# Altium project driverv7.PrjPcb
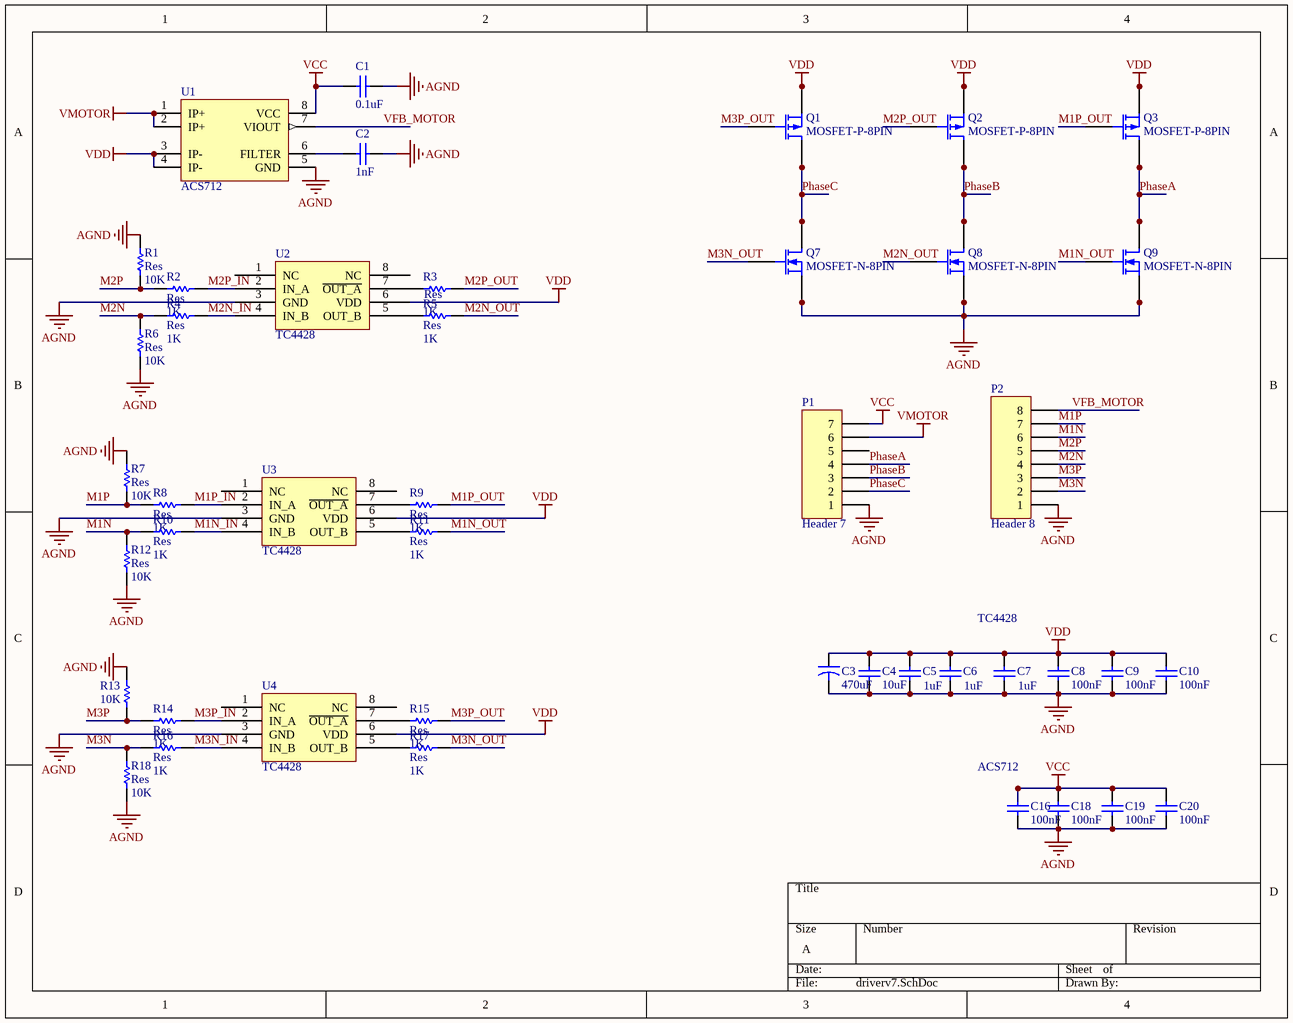
[diagram p0: driverv7.SchDoc]
1 sheet, 44 parts. Net scope: global (net labels, ports and power ports of the same name join across sheets).
Board file: driverv7-FPGA.PcbDoc

## Sheet driverv7.SchDoc
size A

### Parts
C1  value 0.1uF  [2012[0805]]  (hidden comment: Cap_UP)
C2  value 1nF  [2012[0805]]  (hidden comment: Cap_UP)
C3  value 470uF  [7343]  (hidden comment: Cap_El_200V)
C4  value 10uF  [2012[0805]]  (hidden comment: Cap_UP)
C5  value 1uF  [2012[0805]]  (hidden comment: Cap_UP)
C6  value 1uF  [2012[0805]]  (hidden comment: Cap_UP)
C7  value 1uF  [2012[0805]]  (hidden comment: Cap_UP)
C8  value 100nF  [2012[0805]]  (hidden comment: Cap_UP)
C9  value 100nF  [2012[0805]]  (hidden comment: Cap_UP)
C10  value 100nF  [2012[0805]]  (hidden comment: Cap_UP)
C16  value 100nF  [2012[0805]]  (hidden comment: Cap_UP)
C18  value 100nF  [2012[0805]]  (hidden comment: Cap_UP)
C19  value 100nF  [2012[0805]]  (hidden comment: Cap_UP)
C20  value 100nF  [2012[0805]]  (hidden comment: Cap_UP)
P1  Header 7  [HDR1X7]
P2  Header 8  [HDR1X8]
Q1  MOSFET-P-8PIN  [SO-8_N]
Q2  MOSFET-P-8PIN  [SO-8_N]
Q3  MOSFET-P-8PIN  [SO-8_N]
Q7  MOSFET-N-8PIN  [SO-8_N]
Q8  MOSFET-N-8PIN  [SO-8_N]
Q9  MOSFET-N-8PIN  [SO-8_N]
R1  Res  value 10K  [2012[0805]]
R2  Res  value 1K  [2012[0805]]
R3  Res  value 1K  [2012[0805]]
R4  Res  value 1K  [2012[0805]]
R5  Res  value 1K  [2012[0805]]
R6  Res  value 10K  [2012[0805]]
R7  Res  value 10K  [2012[0805]]
R8  Res  value 1K  [2012[0805]]
R9  Res  value 1K  [2012[0805]]
R10  Res  value 1K  [2012[0805]]
R11  Res  value 1K  [2012[0805]]
R12  Res  value 10K  [2012[0805]]
R13  value 10K  [2012[0805]]  (hidden comment: Res)
R14  Res  value 1K  [2012[0805]]
R15  Res  value 1K  [2012[0805]]
R16  Res  value 1K  [2012[0805]]
R17  Res  value 1K  [2012[0805]]
R18  Res  value 10K  [2012[0805]]
U1  ACS712  [8 pin SOIC_N]
U2  TC4428  [8 pin SOIC_M]
U3  TC4428  [8 pin SOIC_M]
U4  TC4428  [8 pin SOIC_M]

### Nets
AGND: C1.2 C2.2 C3.2 C4.1 C5.1 C6.1 C7.1 C8.1 C9.1 C10.1 C16.1 C18.1 C19.1 C20.1 P1.1 P2.1 Q7.1(S) Q7.2(S) Q7.3(S) Q8.1(S) Q8.2(S) Q8.3(S) Q9.1(S) Q9.2(S) Q9.3(S) R1.2 R6.1 R7.2 R12.1 R13.2 R18.1 U1.5(GND) U2.3(GND) U3.3(GND) U4.3(GND)
VCC: C1.1 C16.2 C18.2 C19.2 C20.2 P1.7 U1.8(VCC)
VDD: C3.1 C4.2 C5.2 C6.2 C7.2 C8.2 C9.2 C10.2 Q1.1(S) Q1.2(S) Q1.3(S) Q2.1(S) Q2.2(S) Q2.3(S) Q3.1(S) Q3.2(S) Q3.3(S) U1.3(IP-) U1.4(IP-) U2.6(VDD) U3.6(VDD) U4.6(VDD)
VMOTOR: P1.6 U1.1(IP+) U1.2(IP+)
M1N: P2.6 R10.1 R12.2
M1N_IN: R10.2 U3.4(IN_B)
M1N_OUT: Q9.4(G) R11.2
M1P: P2.7 R7.1 R8.1
M1P_IN: R8.2 U3.2(IN_A)
M1P_OUT: Q3.4(G) R9.2
M2N: P2.4 R4.1 R6.2
M2N_IN: R4.2 U2.4(IN_B)
M2N_OUT: Q8.4(G) R5.2
M2P: P2.5 R1.1 R2.1
M2P_IN: R2.2 U2.2(IN_A)
M2P_OUT: Q2.4(G) R3.2
M3N: P2.2 R16.1 R18.2
M3N_IN: R16.2 U4.4(IN_B)
M3N_OUT: Q7.4(G) R17.2
M3P: P2.3 R13.1 R14.1
M3P_IN: R14.2 U4.2(IN_A)
M3P_OUT: Q1.4(G) R15.2
PhaseA: P1.4 Q3.5(D) Q3.6(D) Q3.7(D) Q3.8(D) Q9.5(D) Q9.6(D) Q9.7(D) Q9.8(D)
PhaseB: P1.3 Q2.5(D) Q2.6(D) Q2.7(D) Q2.8(D) Q8.5(D) Q8.6(D) Q8.7(D) Q8.8(D)
PhaseC: P1.2 Q1.5(D) Q1.6(D) Q1.7(D) Q1.8(D) Q7.5(D) Q7.6(D) Q7.7(D) Q7.8(D)
VFB_MOTOR: P2.8 U1.7(VIOUT)
NetC2_1: C2.1 U1.6(FILTER)
NetR3_1: R3.1 U2.7(~{OUT_A})
NetR5_1: R5.1 U2.5(OUT_B)
NetR9_1: R9.1 U3.7(~{OUT_A})
NetR11_1: R11.1 U3.5(OUT_B)
NetR15_1: R15.1 U4.7(~{OUT_A})
NetR17_1: R17.1 U4.5(OUT_B)

Not connected (* = marked no-connect by the designer): P1 5; U2 1(NC) 8(NC); U3 1(NC) 8(NC); U4 1(NC) 8(NC)

### Notes on the sheet
- TC4428
- (near C16) ACS712

### Library data of the parts
C1 C2 C4-C10 C16 C18-C20 = Cap_UP: Capacitor; Published: 8-Jun-2000; LatestRevisionDate: 17-Jul-2002; LatestRevisionNote: Re-released for DXP Platform.; PackageReference: RAD-0.3; Publisher: Altium Limited
C3 = Cap_El_200V: Capacitor; Published: 23-Sep-2002; PackageReference: CAPR5-4X5; Publisher: Altium Limited
P1 = Header 7: Header, 7-Pin; LatestRevisionDate: 17-Jul-2002; LatestRevisionNote: Re-released for DXP Platform.; Publisher: Altium Limited
P2 = Header 8: Header, 8-Pin; LatestRevisionDate: 17-Jul-2002; LatestRevisionNote: Re-released for DXP Platform.; Publisher: Altium Limited
Q1-Q3 = MOSFET-P-8PIN: P-Channel MOSFET; PackageDocument: 1995/1996; Published: 8-Jun-2000; LatestRevisionDate: 17-Jul-2002; LatestRevisionNote: Re-released for DXP Platform.; PackageReference: E3; Publisher: Altium Limited
Q7-Q9 = MOSFET-N-8PIN: N-Channel MOSFET; PackageDocument: 1995/1996; Published: 8-Jun-2000; LatestRevisionDate: 17-Jul-2002; LatestRevisionNote: Re-released for DXP Platform.; PackageReference: E3; Publisher: Altium Limited
R1-R18 = Res: Semiconductor Resistor; Published: 8-Jun-2000; LatestRevisionDate: 17-Jul-2002; LatestRevisionNote: Re-released for DXP Platform.; PackageReference: AXIAL-0.5; Publisher: Altium Limited
U2-U4 = TC4428: Dual MOSFET Driver